# EAGLE board Radio-86RK-SRAM (EAGLE 6.3), part 1 of 2
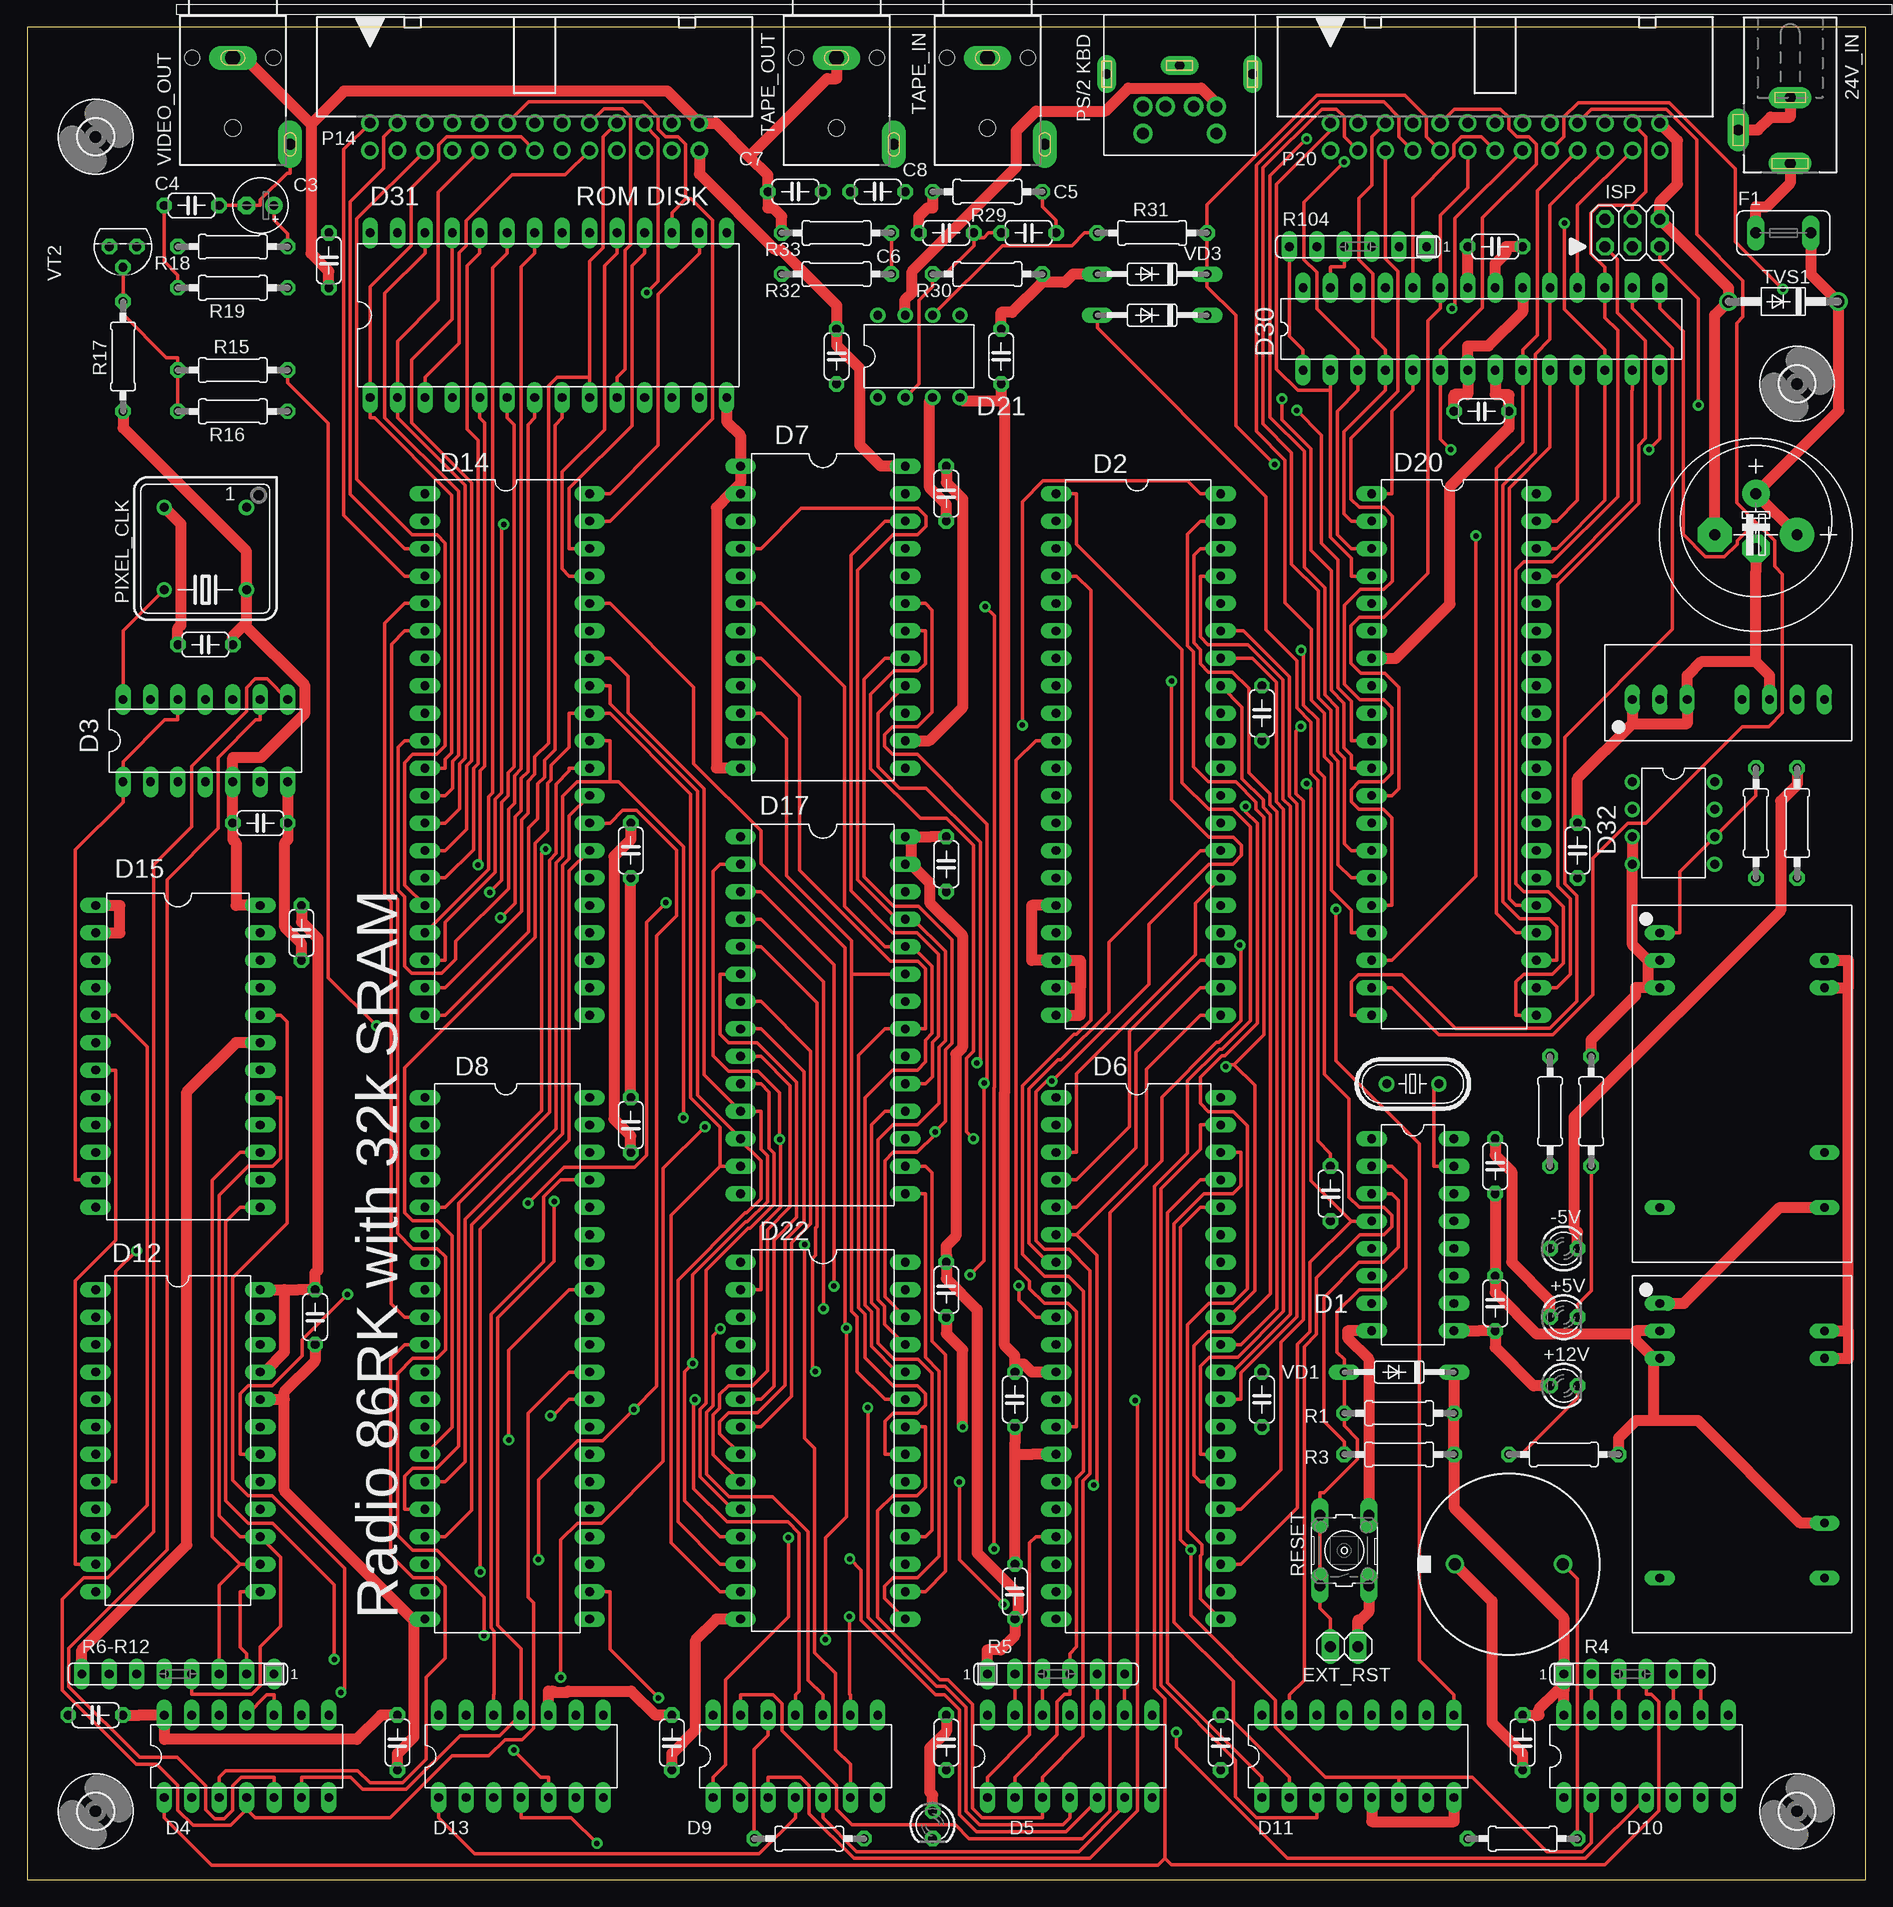
[diagram p8: board, top side]
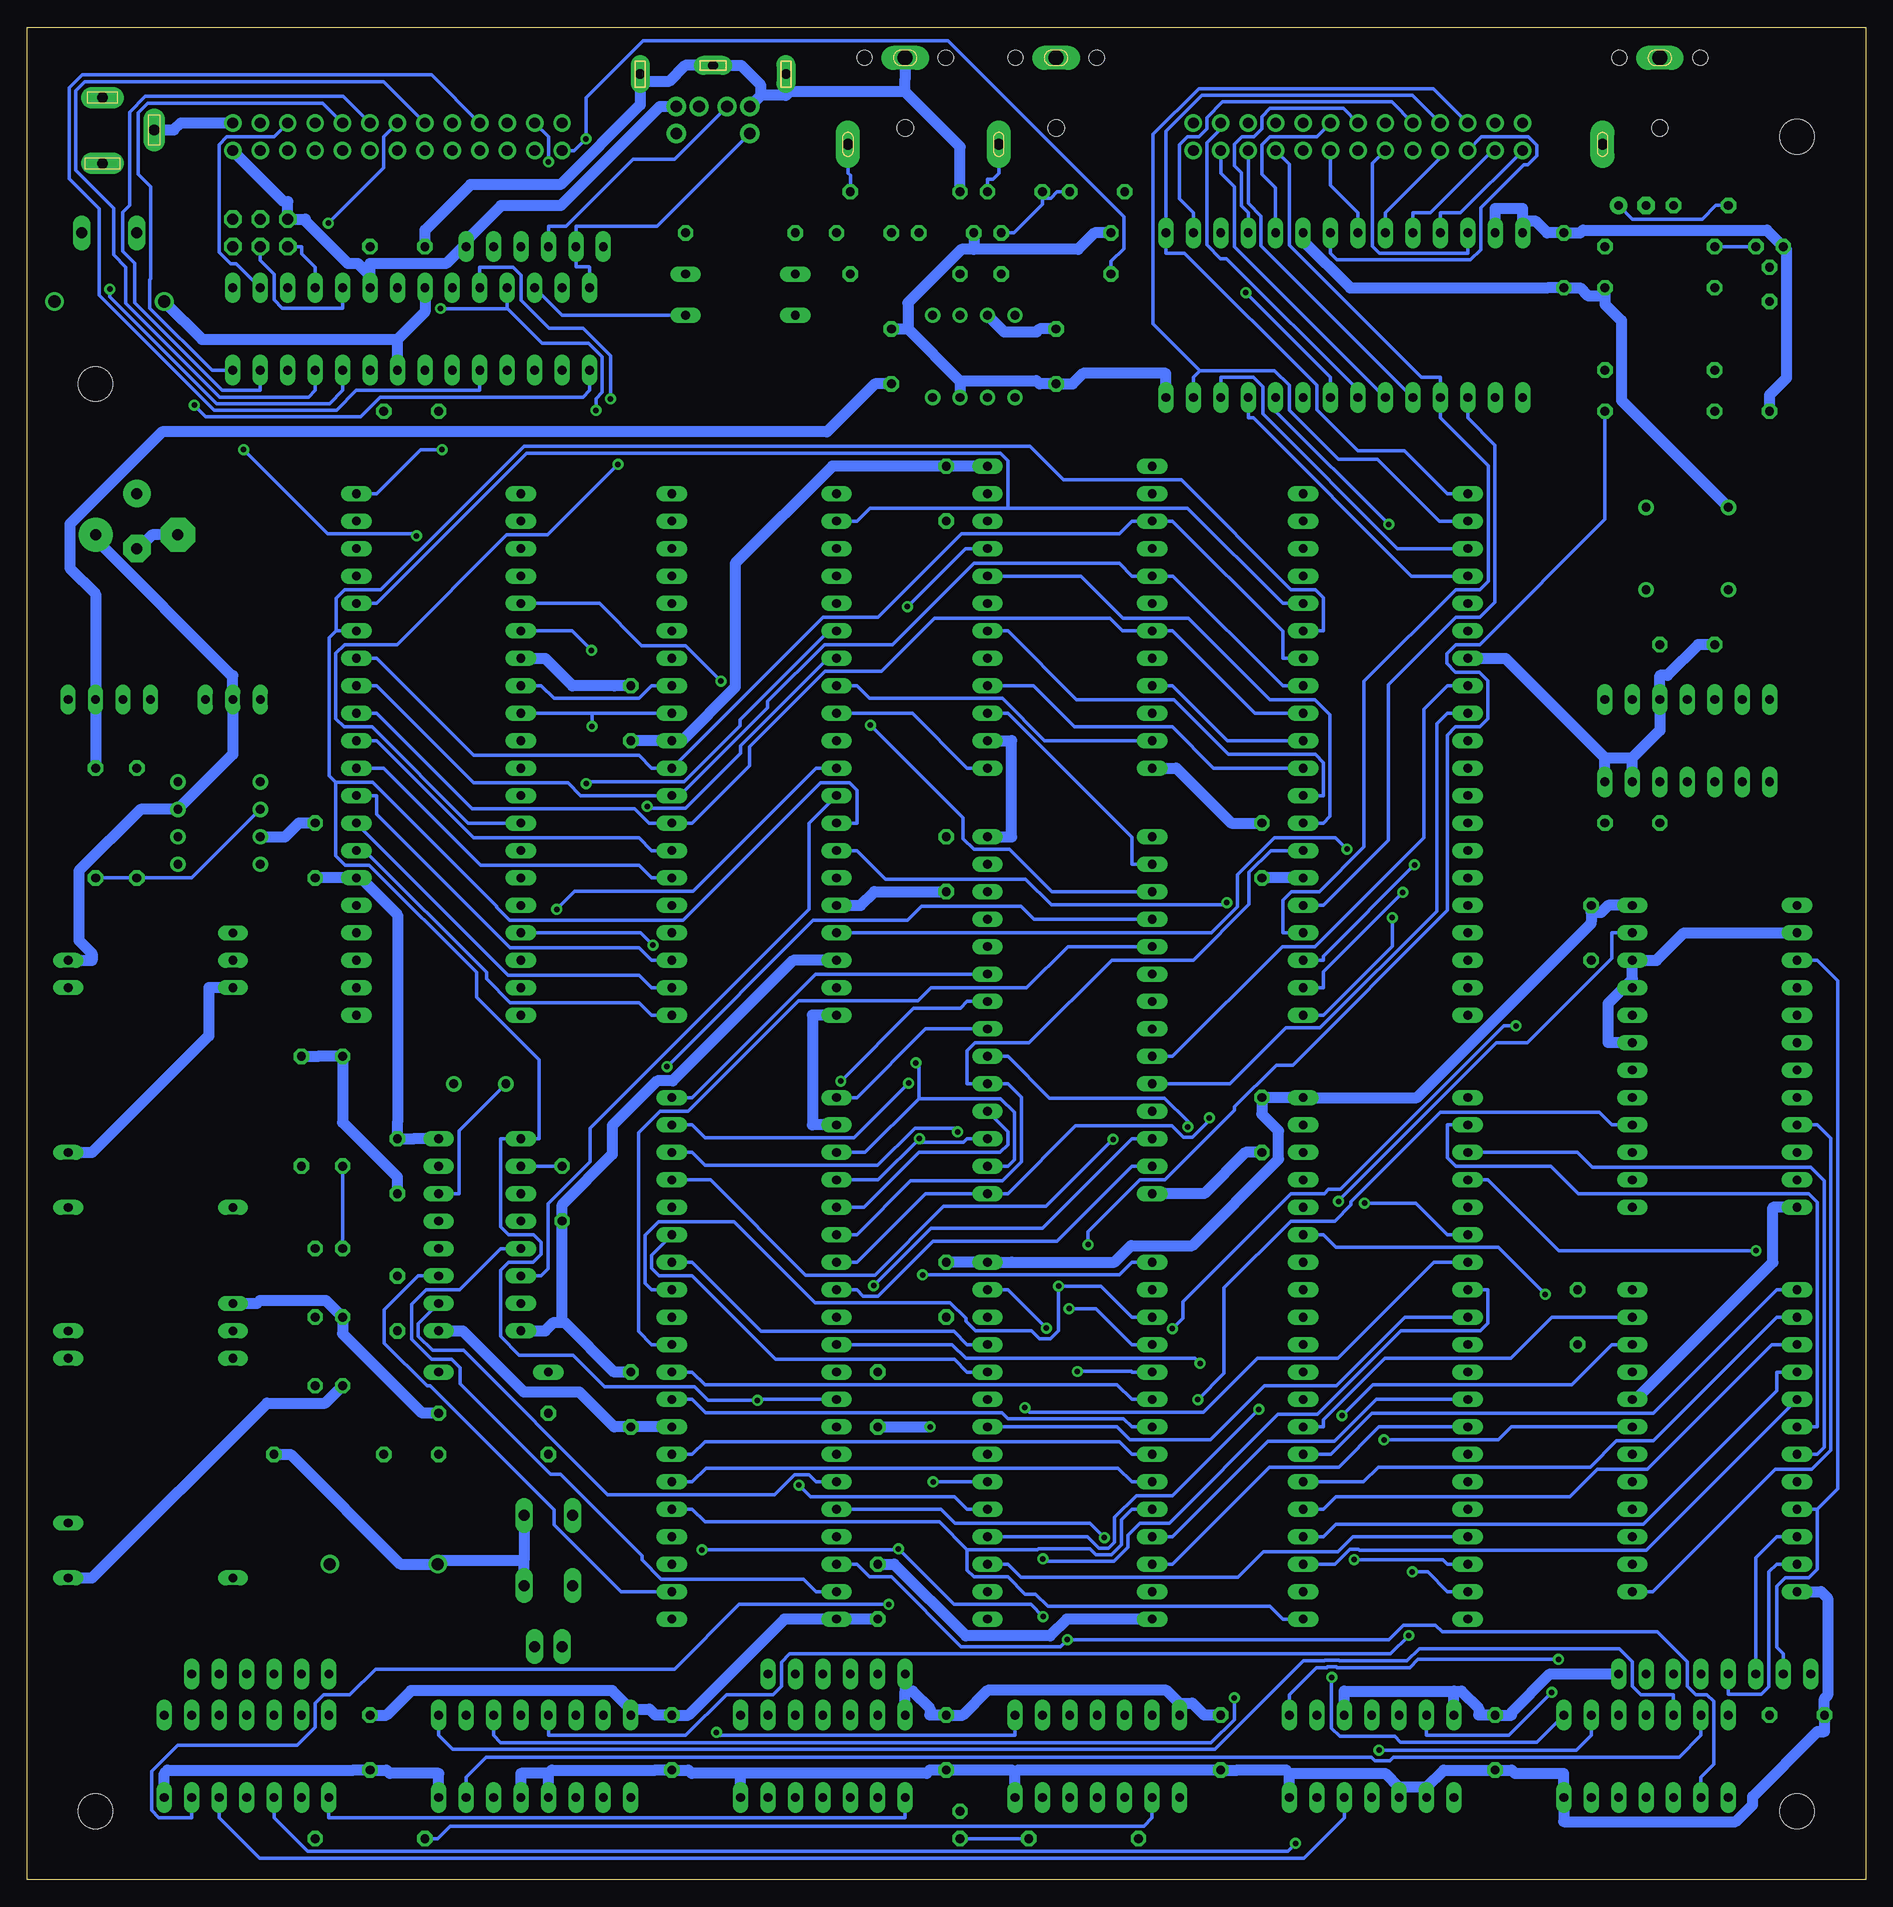
[diagram p9: board, bottom side, seen from below]

Size 170.18 x 171.45 mm. Coordinates in mm from the lower left corner, seen from the top.
Outline: 0,0 170.18,0 170.18,171.45 0,171.45 0,0
Copper layers (1*16): Top 0.035mm / dielectric 1.5mm / Bottom 0.035mm
Design rules "default": minimum track width 8mil, minimum drill 20mil, track to track 8mil, track to pad 8mil, pad to pad 8mil, via to via 8mil, smd to smd 8mil, copper to edge 10mil, drill to drill 8mil, minimum pad ring 12mil, minimum via ring 10mil, stop-mask expansion 4mil, vias tented up to drill 25mil, thermal gap 10mil
Net classes: 0 default: width 0.305 mm, clearance 0.305 mm; 1 power: width 1.016 mm, clearance 0.305 mm

## Footprints (pad centres in the part's own frame; a part is rotated, then mirrored left to right if it is on the bottom)
DCJ0202 = drill 1 pad 2 long: 1 0,3.1; 2 4.8,0; 3 0,-3
LED3MM = drill 0.813 octagon: A -1.27,0; K 1.27,0
3,2 = hole 3.2: 0,0
C050-024X044 = drill 0.813 octagon: 1 -2.54,0; 2 2.54,0
E2,5-5 = drill 0.813 pad 1.6: + -1.27,0 | drill 0.813 pad 1.6 octagon: - 1.27,0
E5-13 = drill 1.016 pad 2.54: + -2.54,0 | drill 1.016 pad 2.54 octagon: - 2.54,0
E7,5-18 = drill 1.016 pad 3.15: + -3.81,0 | drill 1.016 pad 3.15 octagon: - 3.81,0
DIL16 = drill 0.813 long: 1 -8.89,-3.81; 2 -6.35,-3.81; 3 -3.81,-3.81; 4 -1.27,-3.81; 5 1.27,-3.81; 6 3.81,-3.81; 7 6.35,-3.81; 8 8.89,-3.81; 9 8.89,3.81; 10 6.35,3.81; 11 3.81,3.81; 12 1.27,3.81; 13 -1.27,3.81; 14 -3.81,3.81; 15 -6.35,3.81; 16 -8.89,3.81
DIL40 = drill 0.813 long: 1 -24.13,-7.62; 2 -21.59,-7.62; 3 -19.05,-7.62; 4 -16.51,-7.62; 5 -13.97,-7.62; 6 -11.43,-7.62; 7 -8.89,-7.62; 8 -6.35,-7.62; 9 -3.81,-7.62; 10 -1.27,-7.62; 11 1.27,-7.62; 12 3.81,-7.62; 13 6.35,-7.62; 14 8.89,-7.62; 15 11.43,-7.62; 16 13.97,-7.62; 17 16.51,-7.62; 18 19.05,-7.62; 19 21.59,-7.62; 20 24.13,-7.62; 21 24.13,7.62; 22 21.59,7.62; 23 19.05,7.62; 24 16.51,7.62; 25 13.97,7.62; 26 11.43,7.62; 27 8.89,7.62; 28 6.35,7.62; 29 3.81,7.62; 30 1.27,7.62; 31 -1.27,7.62; 32 -3.81,7.62; 33 -6.35,7.62; 34 -8.89,7.62; 35 -11.43,7.62; 36 -13.97,7.62; 37 -16.51,7.62; 38 -19.05,7.62; 39 -21.59,7.62; 40 -24.13,7.62
DIL14 = drill 0.813 long: 1 -7.62,-3.81; 2 -5.08,-3.81; 3 -2.54,-3.81; 4 0,-3.81; 5 2.54,-3.81; 6 5.08,-3.81; 7 7.62,-3.81; 8 7.62,3.81; 9 5.08,3.81; 10 2.54,3.81; 11 0,3.81; 12 -2.54,3.81; 13 -5.08,3.81; 14 -7.62,3.81
DIL24-6 = drill 0.813 long: 1 -13.97,-7.62; 2 -11.43,-7.62; 3 -8.89,-7.62; 4 -6.35,-7.62; 5 -3.81,-7.62; 6 -1.27,-7.62; 7 1.27,-7.62; 8 3.81,-7.62; 9 6.35,-7.62; 10 8.89,-7.62; 11 11.43,-7.62; 12 13.97,-7.62; 13 13.97,7.62; 14 11.43,7.62; 15 8.89,7.62; 16 6.35,7.62; 17 3.81,7.62; 18 1.27,7.62; 19 -1.27,7.62; 20 -3.81,7.62; 21 -6.35,7.62; 22 -8.89,7.62; 23 -11.43,7.62; 24 -13.97,7.62
DIL24 = drill 0.813 long: 1 -13.97,-7.62; 2 -11.43,-7.62; 3 -8.89,-7.62; 4 -6.35,-7.62; 5 -3.81,-7.62; 6 -1.27,-7.62; 7 1.27,-7.62; 8 3.81,-7.62; 9 6.35,-7.62; 10 8.89,-7.62; 11 11.43,-7.62; 12 13.97,-7.62; 13 13.97,7.62; 14 11.43,7.62; 15 8.89,7.62; 16 6.35,7.62; 17 3.81,7.62; 18 1.27,7.62; 19 -1.27,7.62; 20 -3.81,7.62; 21 -6.35,7.62; 22 -8.89,7.62; 23 -11.43,7.62; 24 -13.97,7.62
DIL28-6 = drill 0.813 long: 1 -16.51,-7.62; 2 -13.97,-7.62; 3 -11.43,-7.62; 4 -8.89,-7.62; 5 -6.35,-7.62; 6 -3.81,-7.62; 7 -1.27,-7.62; 8 1.27,-7.62; 9 3.81,-7.62; 10 6.35,-7.62; 11 8.89,-7.62; 12 11.43,-7.62; 13 13.97,-7.62; 14 16.51,-7.62; 15 16.51,7.62; 16 13.97,7.62; 17 11.43,7.62; 18 8.89,7.62; 19 6.35,7.62; 20 3.81,7.62; 21 1.27,7.62; 22 -1.27,7.62; 23 -3.81,7.62; 24 -6.35,7.62; 25 -8.89,7.62; 26 -11.43,7.62; 27 -13.97,7.62; 28 -16.51,7.62
DIL08 = drill 0.813 pad 1.27: 1 -3.81,-3.81; 2 -1.27,-3.81; 3 1.27,-3.81; 4 3.81,-3.81; 5 3.81,3.81; 6 1.27,3.81; 7 -1.27,3.81; 8 -3.81,3.81
DIL28-3 = drill 0.813 long: 1 -16.51,-3.81; 2 -13.97,-3.81; 3 -11.43,-3.81; 4 -8.89,-3.81; 5 -6.35,-3.81; 6 -3.81,-3.81; 7 -1.27,-3.81; 8 1.27,-3.81; 9 3.81,-3.81; 10 6.35,-3.81; 11 8.89,-3.81; 12 11.43,-3.81; 13 13.97,-3.81; 14 16.51,-3.81; 15 16.51,3.81; 16 13.97,3.81; 17 11.43,3.81; 18 8.89,3.81; 19 6.35,3.81; 20 3.81,3.81; 21 1.27,3.81; 22 -1.27,3.81; 23 -3.81,3.81; 24 -6.35,3.81; 25 -8.89,3.81; 26 -11.43,3.81; 27 -13.97,3.81; 28 -16.51,3.81
DC/DC_SIP = drill 0.8 long: P$1 -8.89,0; P$2 -6.35,0; P$3 -3.81,0; P$5 1.27,0; P$6 3.81,0; P$7 6.35,0; P$8 8.89,0
DC/DC_24PIN = drill 0.8 long: P$1 -13.97,-7.62; P$2 -11.43,-7.62; P$3 -8.89,-7.62; P$11 11.43,-7.62; P$14 11.43,7.62; P$16 6.35,7.62; P$22 -8.89,7.62; P$23 -11.43,7.62
MINI-DIN6 = drill 0.9 pad 1.778 long: G1 -6.75,5.5; G2 0,4.7; G3 6.75,5.5 | drill 1.1 pad 1.778: P1 1.3,8.5; P2 -1.3,8.5; P3 3.4,8.5; P4 -3.4,8.5; P5 3.4,11; P6 -3.4,11
1X02 = drill 1.016 long: 1 -1.27,0; 2 1.27,0
TE5 = drill 1.016 long: 1 -2.54,0; 2 2.54,0
EFBAA40D101 = drill 1.1 pad 1.676: 1 -5,0; 2 5,0
2X03 = drill 1.016 octagon: 1 -2.54,-1.27; 2 -2.54,1.27; 3 0,-1.27; 4 0,1.27; 5 2.54,-1.27; 6 2.54,1.27
PAK100/2500-5-26 = drill 1 pad 1.422: 1 -15.24,-1.27; 2 -15.24,1.27; 3 -12.7,-1.27; 4 -12.7,1.27; 5 -10.16,-1.27; 6 -10.16,1.27; 7 -7.62,-1.27; 8 -7.62,1.27; 9 -5.08,-1.27; 10 -5.08,1.27; 11 -2.54,-1.27; 12 -2.54,1.27; 13 0,-1.27; 14 0,1.27; 15 2.54,-1.27; 16 2.54,1.27; 17 5.08,-1.27; 18 5.08,1.27; 19 7.62,-1.27; 20 7.62,1.27; 21 10.16,-1.27; 22 10.16,1.27; 23 12.7,-1.27; 24 12.7,1.27; 25 15.24,-1.27; 26 15.24,1.27
DIL08S = drill 0.813: 1 -3.81,-3.81; 4 3.81,-3.81; 5 3.81,3.81; 8 -3.81,3.81
0207/10 = drill 0.813 octagon: 1 -5.08,0; 2 5.08,0
SIL6 = drill 0.813 long: 1 -6.35,0; 2 -3.81,0; 3 -1.27,0; 4 1.27,0; 5 3.81,0; 6 6.35,0
SIL8 = drill 0.813 long: 1 -8.89,0; 2 -6.35,0; 3 -3.81,0; 4 -1.27,0; 5 1.27,0; 6 3.81,0; 7 6.35,0; 8 8.89,0
B3F-10XX = drill 1.016 long: 1 -3.251,2.261; 2 3.251,2.261; 3 -3.251,-2.261; 4 3.251,-2.261
WBTOR1 = drill 1.4 pad 2.2 long: S 0,-4 | drill 1 pad 2.2 long: T 5.3,-12 | hole 1.4: -3.75,-4; 3.75,-4 | hole 1.5: 0,-10.5
DO41-10 = drill 1.118: A 5.08,0; C -5.08,0
DO35-10 = drill 0.813 long: A 5.08,0; C -5.08,0
TO92 = drill 0.813 octagon: 1 1.27,0; 2 0,1.905; 3 -1.27,0
HC49U-V = drill 0.813: 1 -2.413,0; 2 2.413,0

## Placement (x,y rotation side)
24V_IN  DCJ0202  [DCJ0202]  163.19,161.92 180 top
+5V  [LED3MM]  142.24,52.07 0 top
+12V  [LED3MM]  142.24,45.72 0 top
-5V  [LED3MM]  142.24,58.42 0 top
C  [3,2]  6.35,161.29 0 top
C2  0.47  [C050-024X044]  120.65,63.5 270 top
C3  47uF  [E2,5-5]  21.59,154.94 180 top
C4  22n  [C050-024X044]  15.24,154.94 0 top
C5  0.22  [C050-024X044]  92.71,152.4 180 top
C6  2200  [C050-024X044]  85.09,152.4 180 top
C7  0.1  [C050-024X044]  71.12,156.21 180 top
C8  0.1  [C050-024X044]  78.74,156.21 0 top
C9  0.1  [C050-024X044]  91.44,44.45 270 top
C10  0.1  [C050-024X044]  90.17,140.97 90 top
C11  0.1  [C050-024X044]  114.3,44.45 90 top
C12  0.1  [C050-024X044]  135.89,53.34 90 top
C17  0.1  [C050-024X044]  91.44,26.67 90 top
C18  0.1  [C050-024X044]  135.89,66.04 270 top
C19  0.1  [C050-024X044]  55.88,69.85 270 top
C20  0.1  [C050-024X044]  85.09,128.27 270 top
C21  0.1  [C050-024X044]  138.43,12.7 270 top
C22  0.1  [C050-024X044]  114.3,107.95 90 top
C23  0.1  [C050-024X044]  85.09,12.7 270 top
C24  0.1  [C050-024X044]  110.49,12.7 270 top
C25  0.1  [C050-024X044]  59.69,12.7 270 top
C101  0.1  [C050-024X044]  16.51,114.3 180 top
C102  0.1  [C050-024X044]  74.93,140.97 270 top
C103  0.1  [C050-024X044]  135.89,151.13 0 top
C104  0.1  [C050-024X044]  134.62,135.89 0 top
C105  0.1  [C050-024X044]  27.94,149.86 270 top
C106  0.1  [C050-024X044]  25.4,87.63 270 top
C107  0.1  [C050-024X044]  85.09,54.61 270 top
C108  0.1  [C050-024X044]  34.29,12.7 270 top
C109  0.1  [C050-024X044]  6.35,15.24 180 top
C110  0.1  [C050-024X044]  55.88,95.25 90 top
C111  0.1  [C050-024X044]  143.51,95.25 90 top
C112  0.1  [C050-024X044]  26.67,52.07 270 top
C113  0.1  [C050-024X044]  85.09,93.98 270 top
C114  0.1  [C050-024X044]  21.59,97.79 0 top
C115  1000uF  [E5-13]  160.02,125.73 270 top
C116  1000uF  [E7,5-18]  160.02,124.46 180 top
D1  i8224  [DIL16]  128.27,59.69 270 top
D2  i8257  [DIL40]  102.87,104.14 270 top
D3  74LS92N  [DIL14]  16.51,105.41 0 top
D4  74S08N  [DIL14]  20.32,11.43 0 top
D5  74LS86N  [DIL14]  96.52,11.43 0 top
D6  i8080  [DIL40]  102.87,48.26 270 top
D7  8212  [DIL24-6]  73.66,116.84 270 top
D8  8275  [DIL40]  44.45,48.26 270 top
D9  7404N  [DIL14]  71.12,11.43 0 top
D10  74LS00N  [DIL14]  149.86,11.43 0 top
D11  74LS138N  [DIL16]  123.19,11.43 0 top
D12  AT28C16  [DIL24]  13.97,40.64 270 top
D13  74S74N  [DIL14]  45.72,11.43 0 top
D14  8255A  [DIL40]  44.45,104.14 270 top
D15  74198N  [DIL24-6]  13.97,76.2 270 top
D17  AT28C64  [DIL28-6]  73.66,80.01 270 top
D20  8255A  [DIL40]  132.08,104.14 270 top
D21  LT1006  [DIL08]  82.55,140.97 0 top
D22  BS62LV256  [DIL28-6]  73.66,40.64 270 top
D30  ATMega48  [DIL28-3]  134.62,143.51 0 top
D31  AT28C256  [DIL28-6]  48.26,144.78 0 top
D32  LT1006  [DIL08]  152.4,97.79 270 top
D33  5V 1W  [DC/DC_SIP]  157.48,109.22 0 top
D34  5V 10W  [DC/DC_24PIN]  158.75,73.66 270 top
D35  12V 10W  [DC/DC_24PIN]  158.75,39.37 270 top
DIN1  [MINI-DIN6]  106.68,172.59 180 top
EXT_RST  [1X02]  121.92,21.59 0 top
F  [3,2]  163.83,138.43 0 top
F1  1A  [TE5]  162.56,152.4 0 top
H  [3,2]  6.35,6.35 0 top
H1  EFBAA40D101  [EFBAA40D101]  137.16,29.21 180 top
ISP  [2X03]  148.59,152.4 0 top
J  [3,2]  163.83,6.35 0 top
LED  Rus/Lat  [LED3MM]  83.82,5.08 270 top
P14  2526-5  [PAK100/2500-5-26]  46.99,161.29 0 top
P20  2526-5  [PAK100/2500-5-26]  135.89,161.29 0 top
PIXEL_CLK  16MHz  [DIL08S]  16.51,123.19 180 top
R1  2k  [0207/10]  127,43.18 0 top
R3  1k  [0207/10]  127,39.37 0 top
R4  4.7k  [SIL6]  148.59,19.05 0 top
R5  4.7k  [SIL6]  95.25,19.05 0 top
R6-R12  10k  [SIL8]  13.97,19.05 180 top
R15  1k  [0207/10]  19.05,139.7 0 top
R16  680  [0207/10]  19.05,135.89 180 top
R17  1k  [0207/10]  8.89,140.97 270 top
R18  51  [0207/10]  19.05,151.13 180 top
R19  150  [0207/10]  19.05,147.32 180 top
R29  12k  [0207/10]  88.9,156.21 0 top
R30  2.4k  [0207/10]  88.9,148.59 180 top
R31  330  [0207/10]  104.14,152.4 0 top
R32  1k  [0207/10]  74.93,148.59 0 top
R33  1k  [0207/10]  74.93,152.4 0 top
R101  330  [0207/10]  138.43,3.81 0 top
R103  330  [0207/10]  72.39,3.81 0 top
R104  4.7k  [SIL6]  123.19,151.13 180 top
R107  10k  [0207/10]  163.83,97.79 90 top
R108  10k  [0207/10]  160.02,97.79 270 top
R109  1.1k  [0207/10]  142.24,39.37 180 top
R110  330  [0207/10]  140.97,71.12 270 top
R111  330  [0207/10]  144.78,71.12 270 top
RESET  [B3F-10XX]  121.92,30.48 90 top
TAPE_IN  WBTOR1  [WBTOR1]  88.9,172.59 0 top
TAPE_OUT  WBTOR1  [WBTOR1]  74.93,172.59 0 top
TVS1  32V  [DO41-10]  162.56,146.05 180 top
VD1  1N4148  [DO35-10]  127,46.99 180 top
VD3  1N4148DO35-10  [DO35-10]  104.14,148.59 180 top
VD101  1N4148DO35-10  [DO35-10]  104.14,144.78 180 top
VIDEO_OUT  WBTOR1  [WBTOR1]  19.05,172.59 0 top
VT2  2N3904  [TO92]  8.89,151.13 180 top
Z1  16MHz  [HC49U-V]  128.27,73.66 0 top

## Tracks (layer width: path | path; a pad name or v marks a point on that pad's centre or on a via)
!CS_CCRT  (via drill 0.51 pad 1.02)
  Top 0.305: D8.22 53.95,26.67 53.95,21.34 v58.44,16.85
  Bottom 0.305: D11.11 127,13.36 126.32,12.68 60.59,12.68 58.44,14.84 v58.44,16.85
!CS_D14  (via drill 0.51 pad 1.02)
  Top 0.305: v42.29,22.61 42.29,26.14 37.95,30.48 35.71,30.48 34.29,31.9 34.29,46.84 35.71,48.26 37.94,48.26 38.74,49.05 38.74,57.64 37.96,58.42 35.72,58.42 34.31,59.82 34.31,90.76 33.73,91.34 33.73,114.35 34.95,115.57 D14.6
  Bottom 0.305: D11.13 121.92,13.36 109.24,13.36 105.45,17.14 101.11,17.14 100.35,17.91 100.35,20.16 99.58,20.93 43.97,20.93 v42.29,22.61
!CS_D20  (via drill 0.51 pad 1.02)
  Top 0.305: v117.93,113.78 118.14,113.57 118.14,108.7 119.46,107.38 119.46,102.63 120.07,102.02 120.07,74.57 122.36,72.28 122.36,63.17 123.3,62.23 125.6,62.23 126.34,61.49 126.34,60.43 125.6,59.69 123.36,59.69 119.36,55.69 119.36,50.49 118.21,49.33 118.21,18.49 116.84,17.12 D11.15
  Bottom 0.305: D20.6 119.72,115.57 v117.93,113.78
!CS_DMA  (via drill 0.51 pad 1.02)
  Top 0.305: D11.9 132.08,17.12 128.86,20.34 128.86,68.1 121.16,75.8 v121.16,89.79
  Bottom 0.305: D2.11 97.13,102.87 108.53,91.47 119.48,91.47 v121.16,89.79 | D11.9 132.08,13.36 130.79,12.07 60.24,12.07 52.06,20.26 50.12,20.26 50.06,20.31 48.75,20.31 48.7,20.26 42.45,20.26 41.32,21.39 22.8,21.39 21.59,20.18 21.59,17.92 20.79,17.12 17.78,17.12 D4.12
!CS_F000
  Bottom 0.305: D11.7 129.54,9.5 127.69,11.35 45.76,11.35 45.44,11.04 44.03,11.04 43.72,11.35 17.25,11.35 15.24,13.36 D4.13
!CS_RAM  (via drill 0.51 pad 1.02)
  Top 0.305: v86.31,36.83 86.31,29.61 v90.42,25.5
  Bottom 0.305: v90.42,25.5 104.26,25.5 110.26,19.51 137.93,19.51 140.29,17.14 142.72,17.14 143.51,16.35 143.51,14.11 145.16,12.46 156.24,12.46 158.65,10.05 158.65,6.42 157.97,5.74 154.94,5.74 D10.6 | D22.20 v86.31,36.83
!CS_ROM  (via drill 0.51 pad 1.02)
  Top 0.305: v62.75,69.68 58.89,65.83 58.89,38.72 53.19,33.02 50.97,33.02 49.41,31.45 v49.41,18.74
  Bottom 0.305: v62.75,69.68 62.75,70.19 64.89,72.33 75.53,72.33 79.4,76.2 D17.20 | D4.8 30.44,12.75 43.05,12.75 43.59,13.29 48.67,13.29 49.43,14.04 49.43,18.72 v49.41,18.74
!FORCE_CS_ROM  (via drill 0.51 pad 1.02)
  Top 0.305: D13.5 48.26,9.5 47.55,9.5 v45.04,12
  Bottom 0.305: D10.5 152.4,5.74 148.65,1.99 52.01,1.99 48.26,5.74 D13.5 | D4.9 25.4,13.36 26.76,12 v45.04,12
!I/OR
  Top 0.305: 105.33,2.01 105.33,16.75 104.34,17.73 104.34,64.19 107.41,67.25 107.41,73.94 110.34,76.88 110.6,76.88 113.23,79.51 113.23,97.46 111.63,99.06 109.38,99.06 106.91,101.54 106.91,113.82 97.13,123.6 97.13,128.27 D2.1 | 105.33,2.01 105.94,1.4 146.05,1.4 151.03,6.37 151.03,16.49 150.34,17.17 149.86,17.17 R4.4 | 105.33,2.01 104.67,1.35 17.09,1.35 12.7,5.74 D4.1
!MEMW
  Top 0.305: D5.2 91.44,9.5 95.35,13.41 95.35,16.49 96.04,17.17 96.52,17.17 R5.4 96.52,20.93 97.15,21.56 97.15,37.18 97.77,37.8 97.77,54.46 96.38,55.86 94.17,55.86 92.15,57.88 92.15,73.47 96.91,78.24 97.14,78.24 98.46,79.55 98.46,119.32 97.13,120.65 D2.4
!RD  (via drill 0.51 pad 1.02)
  Top 0.305: D14.5 34.95,118.11 33.12,116.28 33.12,91.09 33.7,90.51 33.7,53.32 34.95,52.07 D8.9 | v105.94,110.92 105.94,99.97 109.42,96.49 111.65,96.49 112.42,95.72 112.42,94.79 111.61,93.98 109.4,93.98 103.83,88.41 103.83,82.89 v94.86,73.92 94.35,73.92 93.37,72.94 93.37,59.14 94.18,58.33 96.45,58.33 98.39,56.38 98.39,37.56 97.76,36.92 97.76,13.28 93.98,9.5 D5.3 93.98,7.32 93.98,5.74 88.41,5.74 87.53,6.62 87.53,16.24 85.24,18.53 84.51,18.53 78.74,24.3 78.74,34.17 80.13,35.56 82.38,35.56 83.16,36.34 83.16,41.91 D22.22
  Bottom 0.305: v105.94,110.92 109.22,114.2 113.29,114.2 117.2,118.11 D20.5 | v94.86,73.92 88.11,80.67 83.77,80.67 83.16,81.28 D17.22 | D8.9 42.63,52.07 48.98,45.72 55.63,45.72 60.63,40.72 68.11,40.72 69.31,41.91 D22.22
!RST
  Top 0.305: D1.2 126.34,66.04 127.6,64.78 127.6,56.66 125.55,54.61 123.3,54.61 121.25,52.56 121.25,48.83 121.92,48.16 VD1.A R1.1 121.92,42.01 123.14,40.79 123.14,38.9 120.05,35.81 119.66,35.81 RESET.2 RESET.1 119.66,25.15 120.65,24.16 EXT_RST.1 | VD101.A 99.06,143.61 114.66,128.01 114.66,115.68 117.53,112.81 117.53,108.45 118.85,107.13 118.85,102.38 119.46,101.77 119.46,68.39 120.65,67.21 C2.1
  Bottom 0.305: C2.1 D1.2
!VIDEO  (via drill 0.51 pad 1.02)
  Top 0.305: v61.82,44.45 61.68,44.31 61.68,36.21 64.78,33.12 70.43,33.12 71.46,32.09 71.46,17.46 71.12,17.12 D9.11
  Bottom 0.305: D15.16 23.47,69.85 24.64,71.02 39.36,71.02 47.63,62.75 47.63,62.47 49.14,60.96 53.19,60.96 59.38,54.77 59.38,46.89 v61.82,44.45
!VIDEO_SYNC  (via drill 0.51 pad 1.02)
  Top 0.305: v71.98,58.77 71.98,40.86 72.91,39.92 72.91,21.03 74.83,19.12 74.83,12.05 76.2,10.68 D9.6
  Bottom 0.305: R16.1 24.13,125.9 35.73,114.3 37.92,114.3 38.75,113.47 38.75,112.55 37.96,111.76 35.73,111.76 34.95,110.97 34.95,107.42 35.69,106.68 37.95,106.68 38.71,105.92 38.71,89.72 53.03,75.4 54.54,75.4 58.42,71.52 58.42,71.23 64.88,64.77 67.16,64.77 71.98,59.96 v71.98,58.77 | v71.98,58.77
!WR  (via drill 0.51 pad 1.02)
  Top 0.305: v73.89,22.23 73.89,31.65 75.83,33.59 v75.83,51.04 75.72,51.16 75.72,86.24 67.92,94.03 67.92,97.08 61.72,103.28 61.72,110.34 53.95,118.11 D14.36
  Bottom 0.305: D4.2 15.24,9.5 14.06,10.68 14.06,16.51 14.69,17.14 15.72,17.14 16.48,17.91 16.48,20.16 19.29,22.96 39.2,22.96 39.81,23.58 42.77,23.58 44.12,22.23 v73.89,22.23 74.54,21.58 83.71,21.58 90.17,28.04 92.2,28.04 93.37,29.21 D6.18 | v75.83,51.04 79.4,54.61 D22.27 | D2.2 93.37,125.73 92.17,126.93 79.4,126.93 | D14.36 53.95,118.11 62.77,126.93 79.4,126.93 | D20.36 137.82,118.11 123.93,132 80.09,132 79.4,131.3 79.4,126.93
+5V
  Top 1.016: 48.88,17.36 48.86,17.36 48.81,17.41 48.69,17.41 48.63,17.47 48.26,17.47 D13.10 | 48.88,17.36 | 48.88,17.36 49.97,17.36 50.09,17.47 55.93,17.47 58.17,15.24 C25.1 | C106.1 25.4,88.65 26.92,87.12 26.92,56.39 26.67,56.13 C112.1 25.15,54.61 23.83,54.61 | D7.24 79.04,130.81 77.09,132.77 77.09,139.83 74.93,141.99 C102.1 74.93,145.7 69.77,150.85 69.24,150.85 62.23,157.86 P14.25 | 142.24,17.47 R4.1 142.24,24.27 132.08,34.43 R3.2 R1.2 VD1.C | C21.1 139.95,15.24 139.95,15.82 141.61,17.47 142.24,17.47 | D10.14 142.24,17.47 | 81.84,96.52 83.57,96.52 C113.1 | 81.84,96.52 81.84,93.98 | R17.2 8.89,134.37 20.32,122.94 PIXEL_CLK.8 20.32,116.33 20.12,116.13 | C104.1 132.08,137.41 132.13,137.47 133.35,137.47 133.35,139.4 D30.7 133.35,141.94 135.28,141.94 138.43,145.08 D30.20 | D15.24 19.36,90.17 19.36,95.96 19.05,96.27 C114.1 D3.5 19.05,103.83 21.63,103.83 25.69,107.89 25.69,110.57 20.12,116.13 | D12.24 23.83,54.61 | 23.83,54.61 23.83,48.83 21.98,46.99 D12.21 | C18.1 135.89,67.06 137.41,65.53 137.41,57.15 140.97,53.59 +5V.A | D17.27 81.84,93.98 | D17.28 81.84,96.52 | D21.7 81.28,146.25 81.91,146.88 81.91,148.84 91.57,158.5 91.57,161.84 93.4,163.66 99.8,163.66 101.94,165.79 108.7,165.79 110.08,164.41 DIN1.P4 | C19.1 C110.1 | C101.1 19.05,115.06 20.12,116.13 | 81.84,93.98 83.54,92.28 83.54,90.44 86.57,87.41 86.57,77 85.98,76.41 85.98,59.56 85.09,58.67 85.09,57.91 C107.1 85.09,55.63 87.94,52.77 87.94,30.26 91.74,26.46 91.74,24.43 C17.1 91.44,22.61 90.12,21.28 88.9,21.28 R5.1 | D7.14 83.52,105.41 86.61,108.51 86.61,127.76 85.09,129.29 C20.1 | C108.1 32.77,15.24 30.53,13 12.7,13 D4.14 10.41,15.24 C109.1
  Top 1.016: D34.P$14 162.24,62.23 153.35,53.34 D35.P$1 | C23.1 85.09,13.72 83.56,12.18 83.56,8.14 83.82,7.87 LED.A
  Bottom 1.016: D15.24 23.83,90.17 24.49,89.51 25.4,89.51 | 25.4,89.51 25.4,88.65 25.4,88.51 41.52,72.39 D8.40 C19.1 55.88,70.87 54.33,69.32 54.33,66.69 62.33,58.69 67.98,58.69 69.52,57.15 79.04,57.15 D22.28 C107.1 | C106.1 25.4,89.51 | 138.43,148.44 139.55,149.56 140.48,149.56 144.42,153.5 144.42,153.67 ISP.2 146.05,155.3 146.41,155.3 P20.25 | 138.43,148.44 138.43,149.56 131.39,149.56 129.54,151.41 | D30.20 138.43,148.44 | 129.54,151.41 129.54,151.69 126.3,154.93 120.78,154.93 111.61,164.09 DIN1.P4 | R104.1 129.54,151.41 | R1.2 133.6,43.18 140.97,50.55 +5V.A 142.51,53.61 148.64,53.61 148.91,53.34 D35.P$1 | C22.1 D2.31 109.57,105.41 104.62,110.36 104.62,121.82 95.63,130.81 C20.1 D7.24 | D31.27 34.29,154.63 31.75,154.63 31.75,153.52 | D21.7 79.74,143.24 76.72,143.24 76.45,143.51 C102.1 | C111.1 D20.26 139.31,92.71 135.89,89.28 135.89,70.1 C18.1 134.31,68.58 D1.16 | D14.26 C110.1 | 38.1,17.47 37.42,17.47 35.81,15.87 35.81,15.24 C108.1 32.77,15.24 32.77,15.5 29.22,19.05 R6-R12.1 | D13.14 38.1,17.47 | 38.1,17.47 48.26,17.47 D13.10 | D31.28 31.75,153.52 | 31.75,153.52 30.58,153.52 29.46,152.4 C105.1 26.42,152.4 26.16,152.65 9.14,152.65 VT2.1 7.33,150.84 7.33,138.97 8.89,137.41 R17.2 | D9.14 63.5,16.34 | C25.1 61.21,15.24 62.32,16.34 63.5,16.34 | 63.5,16.34 64.7,17.54 81.26,17.54 83.57,15.24 C23.1 86.61,15.24 86.61,15.87 88.22,17.47 88.9,17.47 | D5.14 88.9,17.47 | R5.1 88.9,17.47 | D11.16 114.3,15.8 | C17.1 D6.20 97.48,24.13 100.08,24.13 108.97,15.24 C24.1 112.01,15.24 112.57,15.8 114.3,15.8 | D17.28 79.04,96.52 79.04,105.41 D7.14 | C21.1 136.91,15.24 134.64,17.51 116.01,17.51 114.3,15.8
+12V
  Top 1.016: +12V.A 139.45,45.72 135.89,49.28 C12.1 134.31,50.8 D1.9
  Bottom 1.016: D1.9 129.84,50.8 124.17,45.13 119.04,45.13 115.82,41.91 C11.1 D6.28 | +12V.A 142.57,44.12 147.97,44.12 164.15,27.94 D35.P$14
-5V
  Top 1.016: 90.13,136.86 90.52,136.48 90.52,72.93 90.49,72.9 90.49,49.46 91.44,48.51 91.44,47.75 | -5V.K 143.51,59.94 143.19,60.26 143.19,70.58 162.31,89.69 162.31,99.82 163.83,101.35 R107.2 | C9.1 91.44,47.75 | 91.44,47.75 92.25,47.75 93.02,46.99 D6.11 | C10.1 90.17,136.91 90.13,136.86 | D21.4 86.66,136.86 90.13,136.86
  Bottom 1.016: R107.2 D33.P$7 163.83,118.99 166.22,121.38 166.22,125.45 157.69,133.98 96.14,133.98 91.69,138.43 C10.1
A0  (via drill 0.51 pad 1.02)
  Top 0.305: D22.10 65.29,34.29 62.29,37.28 62.29,43.53 62.87,44.1 62.87,56.39 66.76,60.28 66.91,60.28 69.14,62.51 69.14,67.25 68.7,67.69 68.7,72.88 67.92,73.66 D17.10 | v117.89,106.73 117.47,106.3 117.47,100.51 118.14,99.84 118.14,51.85 116.04,49.75 116.04,37.96 112.37,34.29 D6.25
  Bottom 0.305: D17.10 58.85,73.66 53.67,78.83 50.5,78.83 39.7,89.64 39.7,106.96 39.69,106.96 38.71,107.95 D14.9 | 83.17,30.54 76.67,30.54 76.55,30.66 71.81,30.66 71.23,30.09 69.82,30.09 68.9,31.01 68.9,33.31 67.92,34.29 D22.10 | 117.89,107.95 D20.9 | D2.32 117.89,107.95 | 117.89,107.95 v117.89,106.73 | D6.25 108.61,34.29 107.44,33.12 85.74,33.12 83.17,30.54 | D8.21 53.95,24.13 55.12,25.3 75.7,25.3 76.83,26.43 77.79,26.43 79.4,28.04 82.54,28.04 83.17,28.67 83.17,30.54
A1
  Top 0.305: D22.9 63.51,39.36 63.51,43.03 64.12,43.64 64.12,44.92 64.92,45.72 67.15,45.72 68.53,47.1 68.53,60.18 70.63,62.28 70.63,73.49 67.92,76.2 D17.9 | D2.33 112.47,108.51 112.47,101.91 114.42,99.96 114.42,99.24 115.09,98.57 115.09,54.24 111.54,50.7 109.28,50.7 108,49.42 108,37.44 108.61,36.83 D6.26
  Bottom 0.305: D14.8 38.71,110.49 40.87,108.33 40.87,96.45 50.96,86.36 54,86.36 64.16,76.2 D17.9 | D22.9 67.92,36.83 69.19,38.1 107.34,38.1 108.61,36.83 D6.26 | D20.8 122.58,110.49 121.41,109.32 113.54,109.32 112.37,110.49 D2.33
A2
  Top 0.305: D17.8 67.92,78.74 71.9,74.76 71.9,60.96 70.15,59.21 70.15,45.75 67.6,43.21 64.93,43.21 64.12,42.39 64.12,41.29 D22.8 | D6.27 108.61,39.37 108.61,47.55 109.42,48.36 112.06,48.36 116.31,52.6 116.31,99.08 115.64,99.75 115.64,110.81 113.41,113.03 112.37,113.03 D2.34
  Bottom 0.305: D22.8 67.92,39.37 69.09,40.54 107.44,40.54 108.61,39.37 D6.27
A3
  Top 0.305: D17.7 67.92,81.28 72.51,76.69 72.51,60.71 70.76,58.95 70.76,44.75 67.92,41.91 D22.7 | D2.35 112.37,115.57 112.6,115.57 116.86,111.31 116.86,100.25 117.53,99.58 117.53,52.1 112.37,46.94 112.37,44.45 D6.29
  Bottom 0.305: D22.7 67.92,41.91 68.68,42.67 79.4,42.67 79.94,43.22 107.38,43.22 108.61,44.45 D6.29
A4
  Top 0.305: D22.6 67.92,44.45 69.14,45.67 69.14,59.19 71.24,61.29 71.24,73.8 67.57,77.47 64.93,77.47 64.16,78.24 64.16,83.82 D17.6 | D6.30 111.56,46.99 116.92,52.35 116.92,99.33 116.25,100 116.25,111.06 113,114.3 109.32,114.3 108.61,115.01 108.61,120.65 D2.37
  Bottom 0.305: D6.30 108.61,46.99 107.44,45.82 69.29,45.82 67.92,44.45 D22.6
A5  (via drill 0.51 pad 1.02)
  Top 0.305: v72.96,47.04 72.73,47.28 72.73,57.52 72.99,57.78 72.99,60.33 73.12,60.46 73.12,81.16 67.92,86.36 D17.5 | D6.31 112.37,49.53 115.7,52.86 115.7,98.83 115.03,99.5 115.03,100.52 113.08,102.47 113.08,110.27 111.59,111.76 109.37,111.76 108.61,112.52 108.61,113.84 108,114.45 108,122.58 108.61,123.19 D2.38
  Bottom 0.305: D22.5 67.92,46.99 67.97,47.04 v72.96,47.04 | D17.5 73.85,86.36 77.66,82.55 86.51,82.55 87.7,81.36 98.78,81.36 109.02,71.12 111.59,71.12 113.59,69.12 113.59,50.75 112.37,49.53 D6.31
A6  (via drill 0.51 pad 1.02)
  Top 0.305: v73.72,52.85 73.72,60.19 73.73,60.2 73.73,83.09 67.92,88.9 D17.4 | 111.7,75.44 111.14,75.44 v110.95,75.26 | D6.32 111.21,52.07 113.64,54.5 113.64,73.5 111.7,75.44 | 111.7,75.44 114.48,78.22 114.48,98.32 113.75,99.05 113.75,99.73 111.88,101.6 109.37,101.6 107.96,103.01 107.96,113.63 107.39,114.2 107.39,124.51 108.61,125.73 D2.39
  Bottom 0.305: v73.72,52.85 71.24,52.85 67.92,49.53 D22.4 | D17.4 76.99,88.9 78.2,90.11 87.37,90.11 88.69,88.8 97.42,88.8 v110.95,75.26
A7  (via drill 0.51 pad 1.02)
  Top 0.305: v74.69,54.95 74.69,84.67 67.92,91.44 D17.3 | v92.12,106.86 92.12,127.54 94.04,129.45 107.43,129.45 108.61,128.27 D2.40
  Bottom 0.305: D6.33 112.37,54.61 112.98,55.22 112.98,59.63 111.71,60.9 104.74,60.9 97.25,53.41 84.73,53.41 83.28,51.96 83.28,51.67 82.41,50.8 77.22,50.8 76.49,50.07 75.43,50.07 74.69,50.81 v74.69,54.95 70.8,54.95 67.92,52.07 D22.3 | D17.3 75.32,91.44 79.23,95.35 82.55,95.35 83.54,96.34 83.54,98.28 v92.12,106.86
A8
  Top 0.305: D7.4 67.92,123.19 71.63,126.91 82.48,126.91 83.2,126.19 83.2,125.24 82.42,124.46 80.15,124.46 76.87,121.17 76.87,92.56 80.53,88.9 D17.25 82.02,88.9 84.99,85.92 84.99,77.65 84.4,77.06 84.4,71.85 82.4,69.85 80.14,69.85 78.79,68.49 78.79,53.67 79.38,53.07 79.38,51.43 D22.25
  Bottom 0.305: 84.4,50.77 102.23,50.77 108.61,57.15 D6.34 | 84.4,50.77 | 84.4,50.77 83.16,49.53 D22.25
A9
  Top 0.305: D7.6 67.92,118.11 75.65,110.38 75.65,90.11 79.4,86.36 D17.24 81.97,86.36 83.77,84.55 83.77,78.33 83.16,77.71 83.16,75.69 82.4,74.93 80.13,74.93 77.55,72.35 77.55,53.18 78.16,52.57 78.16,49.37 80.54,46.99 D22.24
  Bottom 0.305: D22.24 83.16,46.99 84.33,48.16 100.89,48.16 108.61,55.88 111.66,55.88 112.37,56.59 112.37,57.81 D6.35
A10
  Top 0.305: D7.8 67.92,113.03 71.49,109.46 71.49,93.41 79.91,84.99 82.48,84.99 83.16,84.3 83.16,78.74 D17.21 79.4,78.74 76.94,76.28 76.94,52.92 77.55,52.31 77.55,48.33 80.17,45.72 82.43,45.72 83.16,44.98 83.16,43.93 82.42,43.18 80.14,43.18 79.4,42.44 79.4,39.37 D22.21
  Bottom 0.305: D17.21 83.16,78.74 87.02,78.74 93.37,72.39 D6.1
A11
  Top 0.305: 76.33,83.82 76.33,86.89 70.29,92.93 70.29,105.58 | 70.29,105.58 | 70.29,105.58 67.92,107.95 D7.10 | 76.33,83.82 79.4,83.82 D17.23 | 76.33,83.82 76.33,52.6 76.82,52.11 76.82,47.03 79.4,44.45 D22.23
  Bottom 0.305: D6.40 108.61,72.39 97.18,83.82 D17.23
A12  (via drill 0.51 pad 1.02)
  Top 0.305: D6.37 108.61,64.77 105.56,61.72 105.56,18.24 114.3,9.5 D11.1 | D22.2 67.92,54.61 67.92,60.43 69.75,62.26 69.75,68.43 v69.67,68.51 69.67,72.83 67.65,74.84 64.95,74.84 63.51,76.28 63.51,93.33 64.16,93.98 D17.2
  Bottom 0.305: D6.37 106.93,64.77 98.13,55.97 91.7,55.97 85.33,62.33 75.85,62.33 v69.67,68.51 | D7.15 79.4,107.95 67.92,96.47 67.92,93.98 D17.2
A13  (via drill 0.51 pad 1.02)
  Top 0.305: D6.38 112.37,67.31 112.37,64.21 111.63,63.47 108.92,63.47 106.17,60.73 106.17,23.85 111.66,18.36 111.66,14.68 116.84,9.5 D11.2 | D7.17 79.4,113.03 77.48,111.11 77.48,92.81 80.21,90.08 82.53,90.08 85.6,87.01 85.6,77.4 85.01,76.81 85.01,70.18 v84.05,69.21 84.05,68.97 82.39,67.31 80.18,67.31 79.4,66.53 79.4,53.95 D22.26
  Bottom 0.305: v84.05,69.21 84.39,69.56 88.01,69.56 91.46,66.11 107.41,66.11 108.61,67.31 D6.38
A14  (via drill 0.51 pad 1.02)
  Top 0.305: v87.28,55.98 88.58,57.28 v88.58,73.73 88.87,74.01 88.87,97.7 82.43,104.14 80.13,104.14 79.37,104.9 79.37,105.95 80.1,106.68 82.41,106.68 83.77,108.04 83.77,117.5 83.16,118.11 D7.19 | D11.3 119.38,5.74 113.78,5.74 111.85,7.68 111.85,11.09 104.95,17.98 104.95,63.94 108.61,67.6 108.61,69.85 D6.39
  Bottom 0.305: D22.1 67.92,57.15 69.09,55.98 v87.28,55.98 | D6.39 108.61,69.85 107.44,68.68 93.63,68.68 v88.58,73.73
A15  (via drill 0.51 pad 1.02)
  Top 0.305: v89.52,30.64 89.52,73.29 89.55,73.33 89.55,116.95 v88.69,117.82 | 127,9.5 133.78,9.5 140.66,2.62 143.97,2.62 144.78,3.43 D10.2 | 127,9.5 120.19,9.5 115.57,14.12 115.57,16.61 107.72,24.47 v107.72,30.53 106.78,31.47 106.78,60.4 108.61,62.23 D6.36 | D11.6 127,9.5 | v76.12,24.36 76.12,17.19 76.2,17.12 D9.9
  Bottom 0.305: v76.12,24.36 77.26,25.5 84.38,25.5 v89.52,30.64 89.62,30.53 v107.72,30.53 | v88.69,117.82 83.31,123.19 D7.21
CLK
  Bottom 0.305: D30.28 118.11,149.2 118.16,149.25 119.38,149.25 R104.5 119.38,153.01 111.86,153.01 DIN1.P5
COMPOSITE_VIDEO
  Top 0.305: C4.2 C3.- 21.58,154.94 21.58,155.45 24.06,157.94 24.35,157.94 VIDEO_OUT.T
D0  (via drill 0.51 pad 1.02)
  Top 0.305: D14.34 53.95,113.03 55.62,111.36 55.62,108 62.66,100.97 62.66,74.5 D17.11 66.34,71.12 67.92,71.12 67.92,67.61 68.53,67 68.53,62.76 66.66,60.89 66.5,60.89 61.61,56.01 v61.61,47.79 60.85,47.02 60.85,35.06 64.16,31.75 D22.11
  Bottom 0.305: D6.10 84.55,49.53 83.28,48.26 62.09,48.26 v61.61,47.79 | D20.34 137.82,113.03 128.84,104.04 113.54,104.04 112.37,102.87 110.79,102.87 D2.30 96.52,116.84 91.41,116.84 83.69,124.56 69.09,124.56 67.92,125.73 D7.3 64.16,125.73 53.95,115.52 53.95,113.03 D14.34 | D22.11 64.16,31.75 55.34,40.57 49.17,40.57 45.29,44.45 D8.12
D1  (via drill 0.51 pad 1.02)
  Top 0.305: 65.86,68.58 65.86,68.79 62.05,72.61 62.05,100.72 53.95,108.81 53.95,110.49 D14.33 | 65.86,68.58 67.92,66.52 67.92,63.02 66.62,61.72 66.45,61.72 60.24,55.5 60.24,33.13 64.16,29.21 D22.12 | D17.12 65.86,68.58 | D6.9 93.37,52.07 91.81,53.63 v91.81,54.99
  Bottom 0.305: D14.33 53.95,110.49 64.11,120.65 D7.5 67.92,120.65 69.09,121.82 82.53,121.82 90.05,114.3 96.38,114.3 101.63,109.05 101.63,108.46 109.76,100.33 D2.29 110.6,100.33 112.37,100.33 118.95,100.33 120.12,101.5 128.83,101.5 137.82,110.49 D20.33 | v91.81,54.99 86.5,60.3 76.2,60.3 67.92,68.58 D17.12 | D22.12 64.16,29.21 55.17,38.2 48.77,38.2 45.06,41.91 38.71,41.91 D8.13
D2
  Top 0.305: 64.16,66.04 64.16,69.63 61.44,72.35 61.44,100.46 53.95,107.95 52.37,107.95 D14.32 50.19,107.95 50.19,104.81 48.5,103.12 48.5,101.78 48.19,101.48 48.19,97.06 47.03,95.91 47.03,87.23 34.94,75.14 34.94,61.75 35.7,60.99 37.96,60.99 39.35,59.6 39.35,41.89 D8.14 | 64.16,66.04 59.63,61.51 59.63,31.2 64.16,26.67 D22.13 | D17.13 64.16,66.04
  Bottom 0.305: D14.32 56.54,107.95 64.16,115.57 D7.7 67.92,115.57 68.78,115.57 69.95,116.74 86.19,116.74 91.08,111.85 96.32,111.85 103.3,104.87 103.3,103.1 108.61,97.79 D2.28 110.79,97.79 112.37,97.79 112.61,97.79 113.96,99.13 129,99.13 137.82,107.95 D20.32 | D17.13 67.92,66.04 74.87,59.09 86.32,59.09 91.39,54.02 92.78,54.02 93.37,54.61 D6.8
D3  (via drill 0.51 pad 1.02)
  Top 0.305: 53.95,101.6 54.73,101.6 60.75,95.59 v60.75,70.5 | 53.95,101.6 50.93,101.6 49.58,100.25 49.58,94.73 48.97,94.12 48.97,69.52 40.57,61.11 40.57,38.69 38.71,36.83 D8.15 | D6.7 94.5,57.15 92.76,58.88 92.76,73.19 95.43,75.87 95.7,75.87 100.12,80.29 100.12,86.76 108.61,95.25 D2.27 | D14.31 53.95,105.41 53.95,101.6 | D22.15 79.35,26.06 79.35,27.16 80.13,27.94 82.4,27.94 84.42,29.96 84.42,47.08 83.16,48.34 83.16,63.5 D17.15
  Bottom 0.305: v60.75,70.5 60.75,70.27 62.3,68.71 63.15,68.71 64.19,69.76 73.14,69.76 79.4,63.5 D17.15 82.22,63.5 83.16,63.5 87.02,63.5 93.37,57.15 D6.7 | v60.75,70.5 | D20.31 137.82,105.41 128.83,96.42 113.54,96.42 112.37,95.25 D2.27 | D7.9 65.1,110.49 64.16,110.49 59.08,105.41 D14.31
D4  (via drill 0.51 pad 1.02)
  Top 0.305: D6.3 97.13,67.31 97.13,74.59 108.15,85.61 108.15,90.37 D2.26 | v87.91,75.61 88.23,75.93 88.23,96.03 83.23,101.02 80.75,101.02 78.76,103.02 78.76,107.97 D7.16 | D14.30 50.19,102.87 50.19,102.62 48.97,101.4 48.97,94.98 48.36,94.37 48.36,71.02 39.96,62.61 39.96,40.13 37.93,38.1 35.69,38.1 34.95,37.36 34.95,34.29 D8.16 | D22.16 83.16,26.67 85.03,28.54 85.03,48.57 83.77,49.83 83.77,65.43 83.16,66.04 D17.16
  Bottom 0.305: 87.62,72.29 80.06,72.29 78.79,71.02 78.79,66.65 79.4,66.04 D17.16 | 87.62,72.29 92.6,67.31 93.37,67.31 D6.3 | v87.91,75.61 87.62,75.32 87.62,72.29 | D20.30 137.17,102.87 128.18,93.88 113.54,93.88 112.37,92.71 D2.26 | D7.16 77.04,110.49 73.23,106.68 64.16,106.68 60.35,102.87 D14.30
D5  (via drill 0.51 pad 1.02)
  Top 0.305: D14.29 50.19,98.45 50.19,94.47 49.58,93.86 49.58,69.05 41.18,60.64 41.18,34.22 38.71,31.75 D8.17 | D7.18 83.16,115.57 83.16,112.54 82.48,111.86 80.25,111.86 78.09,109.7 78.09,102.83 82.69,98.23 85.09,98.23 87.58,95.73 87.58,76.65 86.94,76.01 86.94,69.22 v87.58,68.58 | D6.4 97.13,64.77 102.02,69.66 102.02,78.5 108.61,85.09 D2.23
  Bottom 0.305: D8.17 47.46,31.75 48.83,30.38 55.72,30.38 58.1,28.01 78.2,28.01 79.4,29.21 D22.17 | D20.29 137.82,100.33 137.82,98.59 125.49,86.26 113.54,86.26 112.37,85.09 D2.23 | D17.17 83.16,68.58 83.49,68.25 87.25,68.25 v87.58,68.58 91.39,64.77 D6.4 | D14.29 50.19,100.33 50.19,103.39 50.94,104.14 58.96,104.14 64.04,109.22 73.05,109.22 79.4,115.57 D7.18
D6  (via drill 0.51 pad 1.02)
  Top 0.305: v47.34,29.64 47.34,37.01 50.98,40.64 53.27,40.64 v56.17,43.54 58.28,45.65 58.28,87.35 60.13,89.2 60.13,95.27 56.44,98.96 55.12,98.96 53.95,97.79 D14.28 | D2.22 108.61,82.55 102.63,76.57 102.63,67.73 97.13,62.23 D6.5 | D22.18 83.16,31.75 83.77,32.36 83.77,46.86 82.46,48.17 80.25,48.17 78.77,49.65 78.77,52.82 78.18,53.41 78.18,69.9 79.4,71.12 D17.18
  Bottom 0.305: D14.28 50.19,97.79 49.57,98.41 49.57,107.82 50.97,109.22 55.15,109.22 62.67,116.74 68.73,116.74 72.65,120.65 D7.20 | D8.18 38.71,29.21 39.14,29.64 v47.34,29.64 | D6.5 92.69,62.23 87.61,67.31 80.12,67.31 79.4,68.03 79.4,69.24 D17.18 | v56.17,43.54 64.15,35.56 67.51,35.56 69.51,33.57 69.51,31.26 70.07,30.7 70.98,30.7 72.03,31.75 79.4,31.75 D22.18 | D2.22 112.37,82.55 113.54,83.72 125.63,83.72 D20.28
D7  (via drill 0.51 pad 1.02)
  Top 0.305: D14.27 50.19,93.37 50.19,68.44 41.96,60.21 v41.96,28.5 | v98.73,36.53 99.03,36.83 99.03,57.79 97.13,59.69 | 97.13,59.69 103.62,66.18 103.62,75.02 108.61,80.01 D2.21 | D6.6 97.13,59.69 | D7.22 79.4,125.73 76.26,122.59 76.26,91.5 80.13,87.63 82.38,87.63 84.38,85.63 84.38,78.08 83.79,77.48 83.79,74.29 83.16,73.66 D17.19
  Bottom 0.305: D2.21 112.37,80.01 113.54,81.18 125.45,81.18 127.66,83.38 127.66,83.96 138.95,95.25 D20.27 | D14.27 55.03,95.25 57.07,93.22 57.07,90.26 62.24,85.09 69.77,85.09 77.42,77.44 82.42,77.44 83.16,76.71 83.16,73.66 D17.19 79.4,73.66 78.14,72.4 78.14,66.43 79.9,64.67 88.39,64.67 93.37,59.69 D6.6 | v41.96,28.5 40.53,28.5 38.71,26.67 D8.19 | D22.19 83.16,34.29 84.33,35.46 97.66,35.46 v98.73,36.53
D14-PA0
  Top 0.305: P14.2 29.31,160.12 29.31,126.29 34.95,120.65 D14.4
  Bottom 0.305: D14.4 42.02,120.65 56.66,135.28 57.15,135.28 D31.11
D14-PA1
  Top 0.305: P14.4 33.02,161.29 33.02,158.36 29.92,155.26 29.92,128.22 34.95,123.19 D14.3
  Bottom 0.305: D31.12 59.69,139.04 56.66,139.04 55.79,138.17 55.79,135.65 43.34,123.19 38.71,123.19 D14.3
D14-PA2
  Bottom 0.305: 61.62,139.66 54.71,139.66 53.34,138.29 53.34,136 48.8,131.46 45.19,131.46 39.46,125.73 D14.2 | D31.13 62.23,139.05 61.62,139.66 | 61.62,139.66 65.95,143.99 65.95,161.52 61.71,165.75 40.02,165.75 P14.6
D14-PA3
  Bottom 0.305: D14.1 38.71,128.27 42.67,132.23 46.99,132.23 50.8,136.04 50.8,138.29 63.03,150.52 64.77,150.52 D31.15 64.77,161.81 61.43,165.14 41.95,165.14 P14.8
D14-PA4
  Top 0.305: D31.16 62.23,150.52 58.42,146.71 58.42,132.74 53.95,128.27 D14.40
  Bottom 0.305: D31.16 62.23,154.28 63.52,155.56 63.52,160.54 62.75,161.3 61.71,161.3 60.97,162.04 60.97,163.07 59.52,164.52 43.87,164.52 P14.10
D14-PA5
  Top 0.305: D31.17 59.69,154.28 60.96,155.55 | D14.39 53.95,125.73 63.44,135.22 63.44,153.58 61.47,155.55 60.96,155.55 | P14.12 46.41,164.52 57.01,164.52 58.43,163.1 58.43,161.98 59.13,161.28 60.27,161.28 60.96,160.59 60.96,155.55
D14-PA6
  Top 0.305: D14.38 50.19,123.19 50.19,128.76 55.98,134.55 55.98,149.35 57.15,150.52 D31.18
  Bottom 0.305: D31.18 57.15,154.28 57.76,154.89 57.76,157.95 58.41,158.6 58.41,160.6 57.72,161.29 56.61,161.29 55.88,162.02 55.88,163.15 55.12,163.91 48.34,163.91 P14.14
D14-PA7
  Top 0.305: D31.19 54.61,150.52 53.44,149.35 53.44,134.2 49.53,130.29 49.53,121.31 50.19,120.65 D14.37
  Bottom 0.305: D31.19 54.61,156.56 55.87,157.82 55.87,160.55 55.13,161.29 50.8,161.29 P14.16
D14-PB0  (via drill 0.51 pad 1.02)
  Top 0.305: v44.13,125.42 43.92,125.22 43.92,100.57 43.34,99.99 43.34,93.25 38.71,88.62 38.71,85.09 D14.18 | P14.18 53.41,163.9 55.11,163.9 55.88,163.13 55.88,151.31 55.37,150.8 55.37,139.8 54.61,139.04 D31.10
  Bottom 0.305: D31.10 54.61,135.9 v44.13,125.42
D14-PB1
  Top 0.305: 52.07,139.04 49.04,139.04 48.26,138.26 48.26,105.19 46.97,103.9 46.97,102.29 46.36,101.68 46.36,98.7 45.78,98.11 45.78,89.62 38.71,82.55 D14.19 | D31.9 52.07,139.04 | P14.20 53.34,161.29 53.34,151.03 52.07,149.76 52.07,139.04
D14-PB2  (via drill 0.51 pad 1.02)
  Top 0.305: D14.20 38.71,80.01 46.42,87.72 46.42,97.33 47.27,98.19 47.27,101.43 47.88,102.04 47.88,103.61 48.87,104.6 48.87,134.62 49.53,135.28 D31.8 | P14.22 57.15,162.4 58.42,161.13 58.42,147.93 v57.36,146.87
  Bottom 0.305: D31.8 49.53,139.04 v57.36,146.87
D14-PB3  (via drill 0.51 pad 1.02)
  Top 0.305: v43.82,89.03 45.17,90.38 45.17,98.37 45.75,98.95 45.75,101.93 46.36,102.54 46.36,134.65 46.99,135.28 D31.7
  Bottom 0.305: v43.82,89.03 43.82,86.38 50.19,80.01 D14.21 | D31.7 46.99,137.88 59.14,150.03 59.71,150.03 60.97,151.29 60.97,160.76 59.69,162.04 P14.24
D14-PB4  (via drill 0.51 pad 1.02)
  Top 0.305: v42.84,91.38 43.95,92.49 43.95,99.73 44.53,100.32 44.53,102.44 45.09,103 45.09,134.64 44.45,135.28 D31.6
  Bottom 0.305: v42.84,91.38 50.19,84.02 50.19,82.55 D14.22 | D31.6 58.42,151.13 58.42,156.67 59.69,157.94 P14.23
D14-PB5  (via drill 0.51 pad 1.02)
  Top 0.305: v41.75,93.92 41.96,94.14 41.96,102.62 42.37,103.03 42.37,134.82 41.91,135.28 D31.5
  Bottom 0.305: v41.75,93.92 50.19,85.48 50.19,85.09 D14.23 | D31.5 55.97,151.22 55.97,153.96 57.15,155.14 P14.21
D14-PB6
  Bottom 0.305: D14.24 53.95,87.63 53.95,90.65 53.16,91.44 50.57,91.44 46.43,95.58 46.43,110.9 37.94,119.38 35.7,119.38 34.93,120.16 34.93,130.84 39.37,135.28 D31.4 39.37,137.27 39.37,139.04 41.11,139.04 53.33,151.26 53.33,158.74 P14.19
D14-PB7
  Top 0.305: D31.3 36.83,139.04 39.98,142.19 39.98,150.57 40.64,151.23 40.64,153.52 44.9,157.78 49.83,157.78 P14.17
  Bottom 0.305: D14.25 50.19,90.17 44.18,96.18 44.18,110.58 37.93,116.84 35.69,116.84 34.31,118.22 34.31,132.76 36.83,135.28 D31.3
D14-PC0
  Top 0.305: D31.25 39.37,150.52 39.37,144.41 35.6,140.65 35.6,134.84 41.15,129.29 41.15,103.54 40.69,103.08 40.69,97.23 38.71,95.25 D14.14
  Bottom 0.305: P14.1 37.49,154.28 39.37,154.28 D31.25
D14-PC1
  Top 0.305: D14.15 38.71,92.71 41.32,95.32 41.32,102.84 41.76,103.28 41.76,133.2 40.74,134.22 40.74,149.35 41.91,150.52 D31.24
  Bottom 0.305: D31.24 41.91,154.28 40.3,154.28 34.56,160.02 P14.3
D14-PC2
  Top 0.305: P14.5 30.53,153.72 30.53,129.6 35.67,124.46 37.95,124.46 38.71,123.7 38.71,104.92 37.93,104.14 35.71,104.14 34.95,103.38 34.95,92.05 D14.16
  Bottom 0.305: D31.21 49.53,150.52 48.92,149.91 36.57,149.91 35.64,150.84 35.64,154.72 31.64,158.72 31.24,158.72 30.44,159.52 30.44,160.52 31.21,161.29 35.56,161.29 P14.5
D14-PC3
  Top 0.305: D14.17 42.73,93.53 42.73,100.24 43.08,100.59 43.08,149.15 44.45,150.52 D31.23
  Bottom 0.305: P14.7 39.37,159.36 44.45,154.28 D31.23
D14-PC4
  Top 0.305: D14.13 38.71,97.79 40.04,99.12 40.04,103.29 40.54,103.79 40.54,129.03 34.29,135.28 D31.2 34.29,142.39 38.05,146.15 38.05,156.15 P14.9
D14-PC5
  Top 0.305: D14.12 38.71,100.33 39.4,101.02 39.4,103.51 39.93,104.04 39.93,128.49 33.12,135.3 33.12,146.81 36.83,150.52 D31.26
  Bottom 0.305: D31.26 36.83,150.52 45.01,150.52 45.64,151.15 45.64,158.83 P14.11
D14-PC6
  Top 0.305: D14.11 38.71,102.87 38.71,103.68 39.32,104.29 39.32,128.14 32.18,135.28 31.75,135.28 D31.1 31.75,147.42 35.56,151.23 35.56,156.51 38.11,159.06 38.11,160.54 38.85,161.29 45.72,161.29 P14.13
D14-PC7
  Top 0.305: D14.10 34.95,105.41 34.34,104.8 34.34,91.59 34.95,90.98 34.95,84.55 35.59,83.91 38.39,83.91 39.68,85.19 39.68,86.84 44.56,91.73 44.56,99.05 45.14,99.63 45.14,102.19 45.75,102.79 45.75,149.28 46.99,150.52 D31.22
  Bottom 0.305: P14.15 49.53,156.82 46.99,154.28 D31.22
D20-PA0
  Top 0.305: D30.2 120.65,137.82 | P20.2 120.65,161.87 115.66,156.88 115.66,139.77 117.61,137.82 120.65,137.82 | D20.4 122.58,120.65 122.58,122.29 120.65,124.22 120.65,137.82
D20-PA1  (via drill 0.51 pad 1.02)
  Top 0.305: v121.92,158.96 118.18,155.22 118.18,149.94 119.38,148.74 119.38,145.39 123.19,141.58 D30.3 123.19,137.82 121.28,135.91 121.28,124.49 122.58,123.19 D20.3
  Bottom 0.305: P20.4 121.92,161.29 v121.92,158.96
D20-PA2
  Top 0.305: P20.6 124.47,161.3 124.47,156.81 123.27,155.61 123.27,149.92 124.56,148.63 124.56,142.75 125.73,141.58 D30.4 125.73,137.82 121.89,133.98 121.89,126.42 122.58,125.73 D20.2
D20-PA3
  Top 0.305: D20.1 126.34,128.27 126.34,135.89 128.27,137.82 D30.5
  Bottom 0.305: P20.8 132.72,167.01 165.07,167.01 166.27,165.81 166.27,157.42 163.48,154.63 163.48,146.62 152.85,135.99 141.54,135.99 139.71,137.82 128.27,137.82 D30.5
D20-PA4  (via drill 0.51 pad 1.02)
  Top 0.305: v131.77,132.35 130.81,133.31 D30.6 130.81,140.64 130.81,141.58 134.72,145.49 134.72,153.78 139.7,158.76 139.7,160.59 139.01,161.28 137.91,161.28 137.15,162.04 137.15,163.1 136.39,163.86 132.11,163.86 P20.10
  Bottom 0.305: D20.40 137.82,128.27 133.74,132.35 v131.77,132.35
D20-PA5
  Top 0.305: D20.39 141.58,125.73 143.51,127.66 143.51,137.82 D30.11
  Bottom 0.305: P20.12 137.19,166.4 164.82,166.4 165.66,165.56 165.66,158.2 162.16,154.7 162.16,150.37 161.03,149.24 161.03,145.89 152.35,137.21 144.12,137.21 143.51,137.82 D30.11
D20-PA6  (via drill 0.51 pad 1.02)
  Top 0.305: D20.38 141.58,123.19 146.05,127.66 D30.12 146.05,141.58 142.3,145.33 v142.3,153.31
  Bottom 0.305: P20.14 137.16,161.29 137.16,158.45 v142.3,153.31
D20-PA7
  Top 0.305: D20.37 141.58,120.65 148.56,127.63 148.56,137.79 148.59,137.82 D30.13
  Bottom 0.305: D30.13 148.59,137.82 152.09,137.82 160.2,145.93 160.2,149.58 161.32,150.7 161.32,154.32 160.69,154.94 160.69,163.57 159.22,165.04 140.91,165.04 P20.16
D20-PB0  (via drill 0.51 pad 1.02)
  Top 0.305: D20.18 126.34,85.09 134.12,92.87 v134.12,124.35 | D30.14 151.13,133.34 v150.13,132.35
  Bottom 0.305: v150.13,132.35 142.35,124.56 134.32,124.56 v134.12,124.35 | P20.18 142.8,164.39 159,164.39 159.87,163.52 159.87,157.84 158.72,156.69 158.72,148.15 158.81,148.06 158.81,145.45 153.06,139.7 D30.14
D20-PB1
  Top 0.305: 160.01,125.64 161.75,123.91 161.75,121.54 162.47,120.81 162.47,107.99 161.2,106.72 158.76,106.72 149.84,97.79 148.18,97.79 144.94,94.55 144.94,81.89 141.24,78.19 130.7,78.19 126.34,82.55 D20.19 | 160.01,125.64 158.29,123.92 158.29,123.61 157.1,122.42 155.36,122.42 153.28,124.5 153.28,143.29 151.13,145.44 D30.15 | P20.20 144.78,163.83 151.73,163.83 154.54,161.02 154.54,152.27 158.82,147.98 158.82,144.62 158.24,144.03 158.24,127.42 160.01,125.64
D20-PB2
  Top 0.305: D20.20 122.58,80.01 122.58,83.1 123.22,83.74 127.27,83.74 132.18,78.82 140.97,78.82 143.44,81.3 143.44,91.05 142.32,92.17 142.32,105.73 152.31,115.71 152.31,141.73 148.59,145.44 D30.16
  Bottom 0.305: P20.22 147.32,161.29 151.69,161.29 152.41,160.57 152.41,150.6 151.34,149.53 150.8,149.53 D30.16
D20-PB3
  Top 0.305: D20.21 137.82,80.01 137.82,83.1 138.54,83.82 141.19,83.82 142.19,84.82 142.19,90.05 140.8,91.44 138.57,91.44 137.82,92.18 137.82,121.21 138.56,121.95 141.2,121.95 147.23,127.98 147.23,143.37 146.05,144.55 D30.17 146.05,147.44 146.05,149.2 144.76,150.49 144.76,154.2 145.5,154.94 148.59,154.94 | ISP.4 148.59,154.94 | P20.24 149.85,161.3 149.85,156.2 148.59,154.94
D20-PB4
  Top 0.305: ISP.1 147.22,149.96 147.22,145 149.8,142.42 149.8,133.38 149.17,132.75 149.17,127.38 141.7,119.91 141.7,91.94 142.83,90.8 142.83,83.8 141.58,82.55 D20.22 | D30.18 143.51,154.94 P20.23
  Bottom 0.305: D30.18 143.51,149.2 144.78,150.47 144.78,151.13 ISP.1
D20-PB5
  Top 0.305: P20.21 140.97,154.94 D30.19 140.97,142.55 139.6,141.18 139.6,132.04 136.6,129.04 136.6,90.5 138.17,88.93 140.84,88.93 141.58,88.19 141.58,85.09 D20.23
  Bottom 0.305: D30.19 140.97,145.44 146.56,145.44 147.32,146.2 147.32,148.59 148.59,149.86 ISP.3
D20-PB6
  Top 0.305: P20.19 139.78,156.29 139.78,142.93 138.43,141.58 138.43,140.19 D30.9 138.43,133.04 135.99,130.6 135.99,89.46 137.82,87.63 D20.24
D20-PB7  (via drill 0.51 pad 1.02)
  Top 0.305: P20.17 142.24,161.29 142.24,163.13 143.57,164.46 152.01,164.46 158.12,158.36 158.12,151.59 v162.51,147.2 | D30.10 140.97,132.55 137.21,128.79 137.21,90.78 137.82,90.17 D20.25
  Bottom 0.305: v162.51,147.2 162.51,146.51 152.6,136.6 142.19,136.6 140.97,137.82 D30.10
D20-PC0  (via drill 0.51 pad 1.02)
  Top 0.305: v118.44,161.1 115.05,157.71 115.05,135.36 118.23,132.18 118.23,121.44 120.12,119.55 120.12,109.64 121.29,108.46 121.29,104.44 121.95,103.78 121.95,95.88 122.58,95.25 D20.14
  Bottom 0.305: R32.1 69.85,149.76 68.66,150.95 68.66,153.9 84.96,170.2 113.17,170.2 118.44,164.93 v118.44,161.1 119.52,160.02 P20.1
D20-PC1
  Top 0.305: P20.3 121.92,161.29 121.92,163.13 121.18,163.86 119.84,163.86 114.39,158.41 114.39,134.73 117.05,132.06 117.05,121.75 119.51,119.3 119.51,109.39 120.68,108.21 120.68,104.19 121.34,103.53 121.34,93.95 122.58,92.71 D20.15
D20-PC2
  Top 0.305: D20.16 126.34,90.17 126.34,98.28 125.56,99.06 123.28,99.06 122.57,99.77 122.57,100.88 123.29,101.6 125.55,101.6 126.34,102.38 126.34,108.46 125.58,109.22 123.36,109.22 121.95,110.64 121.95,117.96 123.39,119.41 125.61,119.41 126.39,120.19 126.39,126.2 125.58,127 123.31,127 122.55,127.76 122.55,133.4 126.9,137.75 126.9,148.83 125.73,150 P20.5
D20-PC3  (via drill 0.51 pad 1.02)
  Top 0.305: v112.24,86.49 112.37,86.36 112.37,79.51 110.34,77.48 110.09,77.48 105.04,72.43 105.04,66.54 100.24,61.75 100.24,6.37 97.68,3.81 87.21,3.81 85.93,5.08 76.36,5.08 74.93,6.51 74.93,8.74 69.88,13.79 69.88,16.31 69.07,17.12 66.04,17.12 D9.13 | P20.7 127,161.29 127,163.11 125.57,164.53 119.65,164.53 113.78,158.66 113.78,134.04 116.44,131.38 116.44,118.17 118.9,115.71 118.9,109.13 120.07,107.96 120.07,103.94 120.73,103.28 120.73,91.59 122.58,89.74 122.58,87.63 D20.17
  Bottom 0.305: v112.24,86.49 113.38,87.63 122.58,87.63 D20.17
D20-PC4  (via drill 0.51 pad 1.02)
  Top 0.305: v115.48,130.98 111.88,134.57 111.88,144.76 109.22,147.42 VD3.C R31.2 109.22,153.57 109.22,154.98 119.38,165.14 127.52,165.14 129.54,163.12 129.54,161.29 P20.9
  Bottom 0.305: v115.48,130.98 121.99,124.46 125.77,124.46 135.93,114.3 140.8,114.3 141.59,113.5 141.59,107.44 140.84,106.68 138.23,106.68 129.34,97.79 D20.13
D20-PC5
  Top 0.305: P20.11 133.35,156.58 130.81,154.04 D30.23 130.81,145.44 129.64,144.27 129.64,120.89 125.59,116.84 123.33,116.84 122.56,116.06 122.56,112.55 123.45,111.66 125.7,111.66 126.99,110.36 126.99,100.98 126.34,100.33 D20.12
D20-PC6  (via drill 0.51 pad 1.02)
  Top 0.305: v116.17,137.04 116.17,135.1 118.84,132.44 118.84,123.04 120.73,121.15 120.73,110.06 121.9,108.88 121.9,104.75 122.58,104.07 122.58,102.87 D20.11 | P20.13 134.63,161.28 132.77,161.28 132.08,160.59 132.08,159.47 128.27,155.66 D30.24
  Bottom 0.305: D30.24 128.27,149.2 125.18,149.2 124.46,148.48 124.46,146.16 121.86,143.56 118.69,143.56 116.17,141.04 v116.17,137.04
D20-PC7  (via drill 0.51 pad 1.02)
  Top 0.305: P20.15 132.18,153.77 132.18,145.68 v131.9,145.4 | v117.53,135.97 119.8,133.69 119.8,123.67 121.34,122.14 121.34,110.31 122.58,109.07 122.58,105.41 D20.10
  Bottom 0.305: v131.9,145.4 125.77,145.4 125.73,145.44 | 125.73,145.44 122.48,142.19 118.21,142.19 116.94,140.92 116.94,137.64 117.53,137.05 v117.53,135.97 | v117.53,135.97 | D30.25 125.73,145.44
DACK  (via drill 0.51 pad 1.02)
  Top 0.305: v59.13,90.43 57.33,88.63 57.33,67.07 56.22,65.96 49.73,65.96 v46.38,62.61
  Bottom 0.305: v59.13,90.43 59.32,90.23 75.38,90.23 77.75,92.61 90.73,92.61 93.37,95.25 D2.14 | v46.38,62.61 41.63,62.61 38.71,59.69 D8.6
DATA
  Top 0.305: D30.27 120.65,149.2 120.7,149.25 121.92,149.25 R104.4
  Bottom 0.305: R104.4 121.92,153.01 120.28,153.01 114.07,159.22 110.25,159.22 DIN1.P1
DBIN
  Top 0.305: D5.1 88.9,9.5 92.81,13.41 92.81,31.19 93.37,31.75 D6.17
  Bottom 0.305: D10.1 142.24,5.74 88.9,5.74 D5.1
DMA_CLK
  Bottom 0.305: D1.6 122.58,55.88 121.93,56.52 121.93,62.56 118.05,66.45 118.05,69.56 97.8,89.81 97.8,97.78 D2.12
DRQ  (via drill 0.51 pad 1.02)
  Top 0.305: D8.5 38.71,62.23 47.64,71.16 47.64,95.02 v48,95.37
  Bottom 0.305: v48,95.37 49.06,96.43 54.74,96.43 58.16,93 58.16,90.03 60.56,87.63 D2.17
GND  (via drill 0.51 pad 1.02)
  Top 1.016: 160.02,112.71 154.94,112.71 153.67,111.44 D33.P$3 153.67,107 148.59,107 | 160.02,112.71 161.29,111.44 D33.P$6 | 160.02,112.71 160.02,121.11 C115.- | 148.59,107 148.59,107.33 D33.P$1 | 150.57,42.52 154.65,42.52 164.15,33.02 D35.P$16 | 150.57,42.52 148.95,42.52 147.32,40.89 R109.1 | 150.57,42.52 150.57,48.26 | C111.2 143.51,101.92 148.59,107 | EXT_RST.2 123.19,24.03 123.42,24.03 124.18,24.79 RESET.3 | R33.1 69.85,153.92 69.09,154.69 68.58,154.69 C7.2 68.58,157.73 66.85,159.46 | 91.44,39.37 91.44,40.39 C9.2 | C17.2 91.44,39.37 | 91.44,39.37 93.02,39.37 D6.14 | C21.2 138.43,11.68 135.59,14.53 135.59,25.78 H1.2 | D30.8 135.89,137.47 137.11,137.47 137.16,137.41 C104.2 137.16,134.37 131.7,128.91 131.7,118.04 126.69,113.03 D20.7 | 148.91,50.53 148.91,50.8 D35.P$2 | 150.57,48.26 148.91,49.93 148.91,50.53 | 148.91,50.53 139.72,50.53 135.89,54.36 C12.2 C18.2 | D35.P$3 150.57,48.26 | D2.16 93.02,90.17 93.02,85.09 D2.18 96.04,85.09 97.48,85.09 97.48,82.55 | R29.1 83.82,154.69 83.31,154.69 82.55,153.92 C6.2 | C19.2 55.88,68.83 54.33,70.38 54.33,94.72 55.88,96.27 C110.2 | D1.8 122.22,50.8 122.22,50.17 124.18,48.21 RESET.4 | D30.22 C103.1 | D22.14 63.8,24.13 61.88,22.21 61.88,13.88 59.69,11.68 C25.2 | C106.2 25.4,86.61 23.85,88.16 23.85,95.99 24.13,96.27 C114.2 D3.7 | D11.5 124.46,5.38 132.08,5.38 D11.8 | C116.- 156.21,126.85 156.21,144.78 TVS1.A 157.48,147.32 ISP.6 151.13,155.3 152.75,156.92 152.75,160.94 P20.26 | D32.3 D32.4 148.59,86.52 150.02,85.09 | R30.1 93.98,147.83 | VD3.A 96.82,148.59 96.06,147.83 93.98,147.83 | R111.1 144.78,77.72 148.91,81.85 148.91,82.55 150.02,82.55 | D34.P$3 150.02,82.55